# EAGLE design PIN_MOUNT_J002607C (EAGLE 7.7.0)
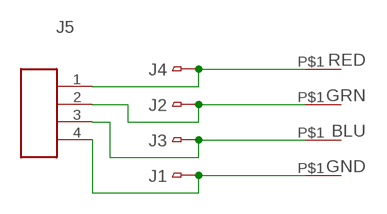
[diagram p0: schematic, sheet 1]

## Parts
BLU  CON10851  [0851_SPRINGPIN]
GND  CON10851  [0851_SPRINGPIN]
GRN  CON10851  [0851_SPRINGPIN]
J1  PADPAD_040  [PAD_040]
J2  PADPAD_040  [PAD_040]
J3  PADPAD_040  [PAD_040]
J4  PADPAD_040  [PAD_040]
J5  CON4DF13-4-TH  [DF13-4-TH]
RED  CON10851  [0851_SPRINGPIN]

## Nets
N$1: BLU.P$1 J3.P$1 J5.3
N$2: GRN.P$1 J2.P$1 J5.2
N$3: GND.P$1 J1.P$1 J5.4
N$4: J4.P$1 J5.1 RED.P$1

## Library data of the parts
BLU GND GRN RED = STEVES_BU:CON1
J1-J4 = STEVES_BU:PAD
J5 = STEVES_BU:CON4

## Board
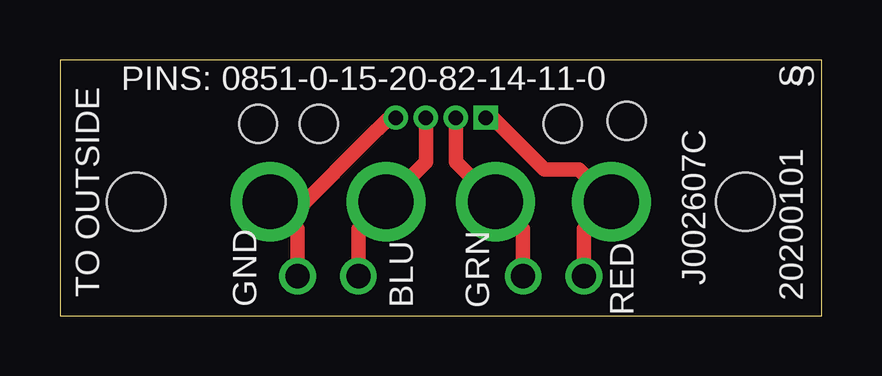
[diagram p1: board, top side]
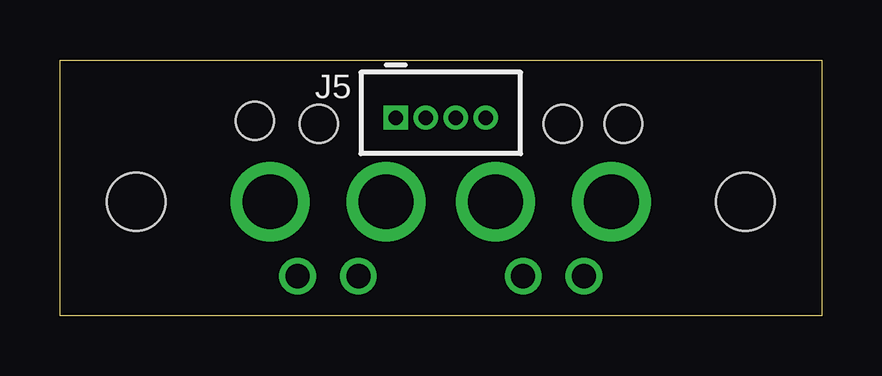
[diagram p2: board, bottom side, seen from below]

Size 31.75 x 10.67 mm. Coordinates in mm from the lower left corner, seen from the top.
Outline: 0,0 31.75,0 31.75,10.67 0,10.67 0,0
Copper layers (1*16): Top 0.035mm / dielectric 1.5mm / Bottom 0.035mm
Design rules "default *": minimum track width 10mil, minimum drill 15mil, track to track 8mil, track to pad 8mil, pad to pad 8mil, via to via 8mil, smd to smd 8mil, copper to edge 30mil, drill to drill 8mil, minimum pad ring 8mil, minimum via ring 8mil, stop-mask expansion 4mil, vias tented up to drill 0mil, thermal gap 10mil
Holes 2.44 mm at 3.18,4.75 28.57,4.75
Holes 1.57 mm at 20.95,8 10.79,8 23.62,8.13 8.25,8

### Footprints (pad centres in the part's own frame; a part is rotated, then mirrored left to right if it is on the bottom)
0851_SPRINGPIN = drill 2.286: P$1 0,0
PAD_040 = drill 1.016: P$1 0,0
DF13-4-TH = drill 0.6 pad 0.889 square: 1 1.875,0 | drill 0.6 pad 0.889: 2 0.625,0; 3 -0.625,0; 4 -1.875,0

### Placement (x,y rotation side)
BLU  13.59,4.75 0 top
GND  8.76,4.75 0 top
GRN  18.16,4.75 0 top
J1  9.91,1.65 0 top
J2  19.3,1.65 0 top
J3  12.45,1.65 0 top
J4  21.84,1.65 0 top
J5  15.88,8.26 180 bottom
RED  22.99,4.75 0 top

### Tracks (layer width: path | path; a pad name or v marks a point on that pad's centre or on a via)
N$1
  Top 0.61: J3.P$1 12.45,3.61 BLU.P$1 15.25,6.41 J5.3
N$2
  Top 0.61: J5.2 16.5,6.41 GRN.P$1 19.3,3.61 J2.P$1
N$3
  Top 0.61: J5.4 13.75,8.26 12.7,7.24 10.21,4.75 GND.P$1 9.91,3.61 J1.P$1
N$4
  Top 0.61: J4.P$1 21.84,3.61 RED.P$1 21.64,6.1 20.19,6.1 18.03,8.26 J5.1

### Text on the board
tPlace: S | S | PINS: 0851-0-15-20-82-14-11-0 | TO OUTSIDE | J002607C | 20200101